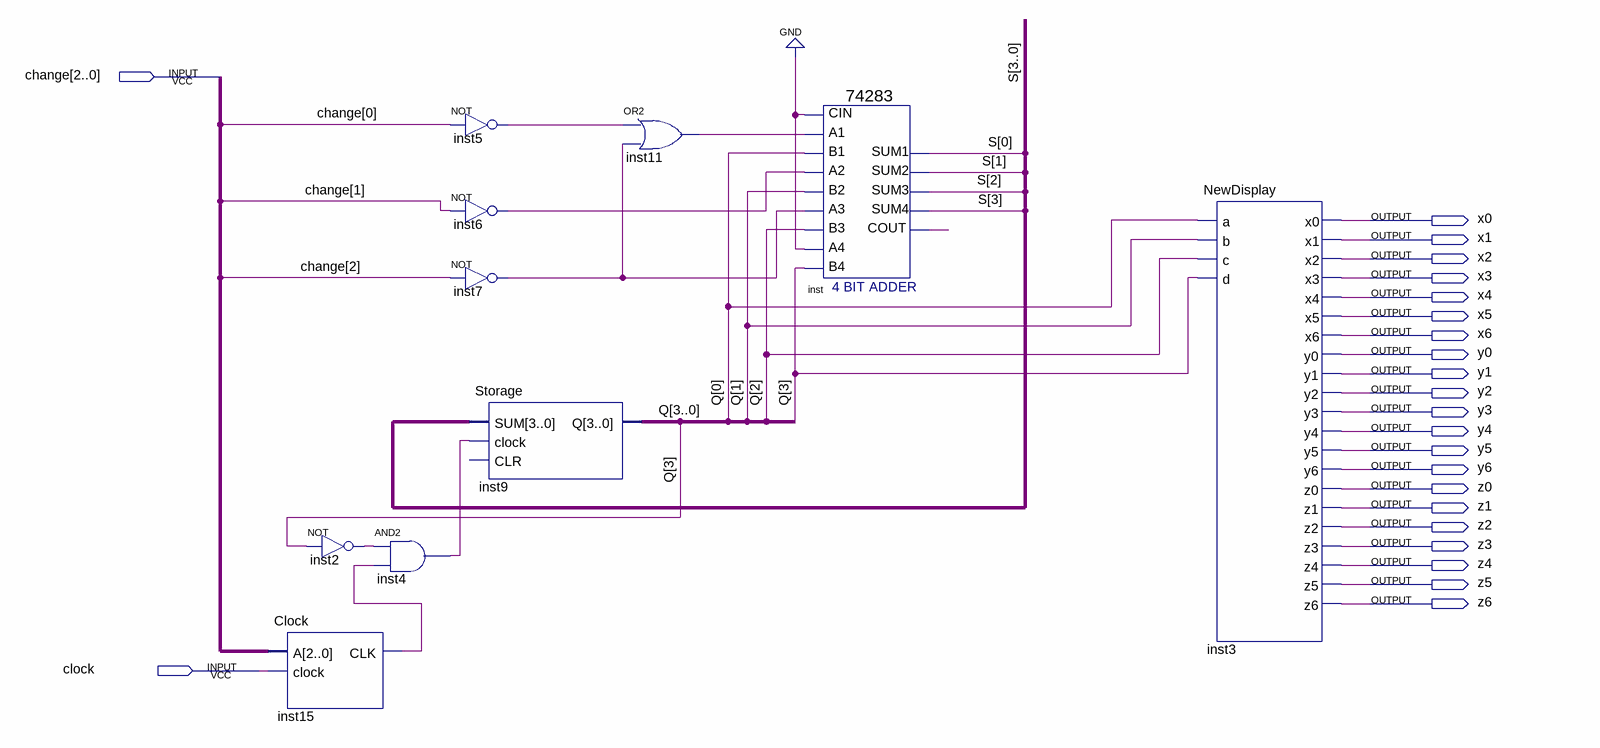
[diagram p0: schematic sheet]
// Quartus schematic CoinCounter.bdf as structural Verilog: 10 symbols, 23 pins
module CoinCounter (
  input  [2:0] change,
  input  clock,
  output x0,
  output x1,
  output x2,
  output x3,
  output x4,
  output x5,
  output x6,
  output y0,
  output y1,
  output y2,
  output y3,
  output y4,
  output y5,
  output y6,
  output z0,
  output z1,
  output z2,
  output z3,
  output z4,
  output z5,
  output z6
);

  wire inst2_out, inst4_out, inst5_out, inst6_out, inst7_out, inst11_out, inst15_clk, inst_cout;
  wire [3:0] Q, S;

  Clock inst15 (.A(change), .clock(clock), .CLK(inst15_clk));
  not inst2 (inst2_out, Q[3]);
  and inst4 (inst4_out, inst2_out, inst15_clk);
  not inst5 (inst5_out, change[0]);
  not inst6 (inst6_out, change[1]);
  not inst7 (inst7_out, change[2]);
  Storage inst9 (.SUM(S), .clock(inst4_out), .Q(Q));  // open: CLR
  or inst11 (inst11_out, inst5_out, inst7_out);
  \74283  inst (
    .CIN(1'b0), .A1(inst11_out), .A2(inst6_out), .B2(Q[1]), .A3(inst7_out), .A4(1'b0), .B4(Q[3]), .B1(Q[0]),
    .B3(Q[2]), .SUM4(S[3]), .COUT(inst_cout), .SUM1(S[0]), .SUM2(S[1]), .SUM3(S[2]));
  NewDisplay inst3 (
    .a(Q[0]), .b(Q[1]), .c(Q[2]), .d(Q[3]), .x0(x0), .x1(x1), .x2(x2), .x3(x3), .x4(x4), .x5(x5), .x6(x6),
    .y0(y0), .y1(y1), .y2(y2), .y3(y3), .y4(y4), .y5(y5), .y6(y6), .z0(z0), .z1(z1), .z2(z2), .z3(z3),
    .z4(z4), .z5(z5), .z6(z6));
endmodule
